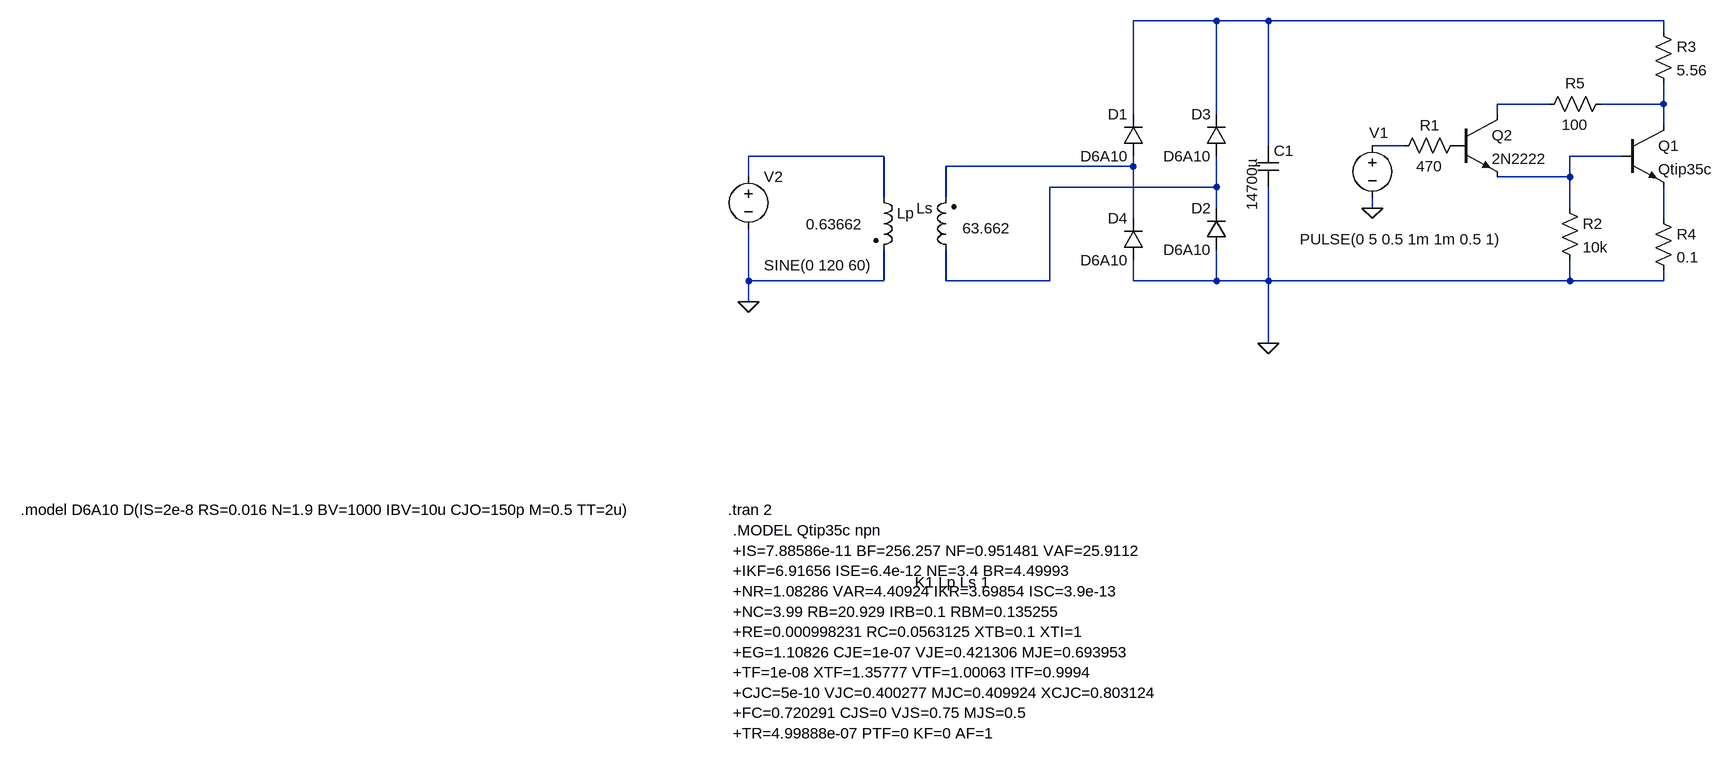
[diagram p0: schematic BJT.asc]
BJT.asc, the LTspice schematic file:
Version 4
SHEET 1 2020 888
WIRE -144 -208 -272 -208
WIRE -64 -208 -144 -208
WIRE 544 -208 -64 -208
WIRE 544 -192 544 -208
WIRE 368 -80 288 -80
WIRE 544 -80 544 -112
WIRE 544 -80 448 -80
WIRE -272 -64 -272 -208
WIRE -144 -64 -144 -208
WIRE 288 -64 288 -80
WIRE 544 -48 544 -80
WIRE -64 -16 -64 -208
WIRE 144 -16 96 -16
WIRE -656 0 -864 0
WIRE 480 0 400 0
WIRE -272 16 -272 0
WIRE -272 16 -560 16
WIRE -864 32 -864 0
WIRE 400 32 400 0
WIRE 400 32 288 32
WIRE -144 48 -144 0
WIRE -144 48 -400 48
WIRE -656 64 -656 0
WIRE -560 64 -560 16
WIRE -144 80 -144 48
WIRE 96 80 96 64
WIRE 400 80 400 32
WIRE -272 96 -272 16
WIRE 544 96 544 48
WIRE -864 192 -864 112
WIRE -656 192 -656 144
WIRE -656 192 -864 192
WIRE -560 192 -560 144
WIRE -400 192 -400 48
WIRE -400 192 -560 192
WIRE -272 192 -272 160
WIRE -144 192 -144 144
WIRE -144 192 -272 192
WIRE -64 192 -64 48
WIRE -64 192 -144 192
WIRE 400 192 400 160
WIRE 400 192 -64 192
WIRE 544 192 544 176
WIRE 544 192 400 192
WIRE -864 224 -864 192
WIRE -64 288 -64 192
FLAG -64 288 0
FLAG -864 224 0
FLAG 96 80 0
SYMBOL diode -256 0 R180
WINDOW 0 24 64 Left 2
WINDOW 3 24 0 Left 2
SYMATTR InstName D1
SYMATTR Value D6A10
SYMBOL diode -128 144 R180
WINDOW 0 24 64 Left 2
WINDOW 3 24 0 Left 2
SYMATTR InstName D2
SYMATTR Value D6A10
SYMBOL diode -128 0 R180
WINDOW 0 24 64 Left 2
WINDOW 3 24 0 Left 2
SYMATTR InstName D3
SYMATTR Value D6A10
SYMBOL diode -256 160 R180
WINDOW 0 24 64 Left 2
WINDOW 3 24 0 Left 2
SYMATTR InstName D4
SYMATTR Value D6A10
SYMBOL cap -80 -16 R0
WINDOW 3 -9 100 VLeft 2
SYMATTR Value 14700µ
SYMATTR InstName C1
SYMATTR SpiceLine V=50 Irms=1.2 Rser=0.044 Lser=13.616n
SYMBOL voltage -864 16 R0
WINDOW 3 24 152 Left 2
WINDOW 123 24 124 Left 2
WINDOW 39 0 0 Left 0
SYMATTR Value SINE(0 120 60)
SYMATTR InstName V2
SYMBOL ind2 -672 48 R0
WINDOW 3 137 63 Left 2
SYMATTR Value 63.662
SYMATTR InstName Lp
SYMATTR Type ind
SYMATTR SpiceLine Rser=0.01
SYMBOL ind2 -544 160 R180
WINDOW 0 36 80 Left 2
WINDOW 3 144 55 Left 2
SYMATTR InstName Ls
SYMATTR Value 0.63662
SYMATTR Type ind
SYMBOL res 240 -32 R90
WINDOW 0 0 56 VBottom 2
WINDOW 3 32 56 VTop 2
SYMATTR InstName R1
SYMATTR Value 470
SYMATTR SpiceLine tol=5 pwr=2
SYMBOL res 384 64 R0
SYMATTR InstName R2
SYMATTR Value 10k
SYMATTR SpiceLine tol=5 pwr=1/4
SYMBOL res 528 -208 R0
SYMATTR InstName R3
SYMATTR Value 5.56
SYMATTR SpiceLine tol=5 pwr=25
SYMBOL npn 480 -48 R0
SYMATTR InstName Q1
SYMATTR Value Qtip35c
SYMBOL voltage 96 -32 R0
WINDOW 123 0 0 Left 0
WINDOW 39 0 0 Left 0
WINDOW 0 -5 -4 Left 2
WINDOW 3 -112 160 Left 2
SYMATTR InstName V1
SYMATTR Value PULSE(0 5 0.5 1m 1m 0.5 1)
SYMBOL res 528 80 R0
SYMATTR InstName R4
SYMATTR Value 0.1
SYMATTR SpiceLine tol=5 pwr=5
SYMBOL npn 224 -64 R0
SYMATTR InstName Q2
SYMATTR Value 2N2222
SYMBOL res 464 -96 R90
WINDOW 0 0 56 VBottom 2
WINDOW 3 32 56 VTop 2
SYMATTR InstName R5
SYMATTR Value 100
TEXT -1984 544 Left 2 !.model D6A10 D(IS=2e-8 RS=0.016 N=1.9 BV=1000 IBV=10u CJO=150p M=0.5 TT=2u)
TEXT -896 544 Left 2 !.tran 2
TEXT -608 656 Left 2 !K1 Lp Ls 1
TEXT -888 576 Left 2 !.MODEL Qtip35c npn\n+IS=7.88586e-11 BF=256.257 NF=0.951481 VAF=25.9112\n+IKF=6.91656 ISE=6.4e-12 NE=3.4 BR=4.49993\n+NR=1.08286 VAR=4.40924 IKR=3.69854 ISC=3.9e-13\n+NC=3.99 RB=20.929 IRB=0.1 RBM=0.135255\n+RE=0.000998231 RC=0.0563125 XTB=0.1 XTI=1\n+EG=1.10826 CJE=1e-07 VJE=0.421306 MJE=0.693953\n+TF=1e-08 XTF=1.35777 VTF=1.00063 ITF=0.9994\n+CJC=5e-10 VJC=0.400277 MJC=0.409924 XCJC=0.803124\n+FC=0.720291 CJS=0 VJS=0.75 MJS=0.5\n+TR=4.99888e-07 PTF=0 KF=0 AF=1

The netlist it stands for:
* BJT.asc
D1 N007 N001 D6A10
D2 0 N008 D6A10
D3 N008 N001 D6A10
D4 0 N007 D6A10
C1 N001 0 14700µ V=50 Irms=1.2 Rser=0.044 Lser=13.616n
V2 N005 0 SINE(0 120 60)
Lp N005 0 63.662 Rser=0.01
Ls N008 N007 0.63662
R1 P001 N004 470 tol=5 pwr=2
R2 N006 0 10k tol=5 pwr=1/4
R3 N001 N003 5.56 tol=5 pwr=25
Q1 N003 N006 N009 0 Qtip35c
V1 N004 0 PULSE(0 5 0.5 1m 1m 0.5 1)
R4 N009 0 0.1 tol=5 pwr=5
Q2 N002 P001 N006 0 2N2222
R5 N003 N002 100
.model D D
.lib standard.dio
.model NPN NPN
.model PNP PNP
.lib standard.bjt
.model D6A10 D(IS=2e-8 RS=0.016 N=1.9 BV=1000 IBV=10u CJO=150p M=0.5 TT=2u)
.tran 2
K1 Lp Ls 1
.MODEL Qtip35c npn
+IS=7.88586e-11 BF=256.257 NF=0.951481 VAF=25.9112
+IKF=6.91656 ISE=6.4e-12 NE=3.4 BR=4.49993
+NR=1.08286 VAR=4.40924 IKR=3.69854 ISC=3.9e-13
+NC=3.99 RB=20.929 IRB=0.1 RBM=0.135255
+RE=0.000998231 RC=0.0563125 XTB=0.1 XTI=1
+EG=1.10826 CJE=1e-07 VJE=0.421306 MJE=0.693953
+TF=1e-08 XTF=1.35777 VTF=1.00063 ITF=0.9994
+CJC=5e-10 VJC=0.400277 MJC=0.409924 XCJC=0.803124
+FC=0.720291 CJS=0 VJS=0.75 MJS=0.5
+TR=4.99888e-07 PTF=0 KF=0 AF=1
.backanno
.end